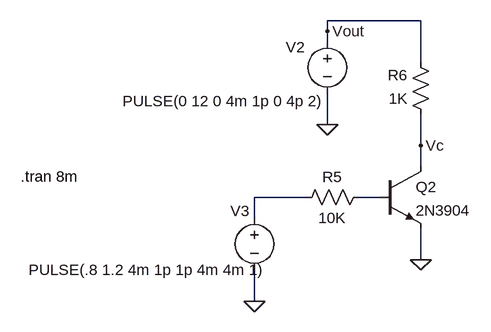
[diagram p0: schematic NPN Basic Configuration.asc]
NPN Basic Configuration.asc, the LTspice schematic file:
Version 4
SHEET 1 1400 680
WIRE 1184 16 1040 16
WIRE 1040 32 1040 16
WIRE 1040 48 1040 32
WIRE 1184 80 1184 16
WIRE 1040 176 1040 128
WIRE 1184 208 1184 160
WIRE 1184 240 1184 208
WIRE 1008 288 928 288
WIRE 1120 288 1088 288
WIRE 928 320 928 288
WIRE 1184 384 1184 336
WIRE 928 448 928 400
FLAG 1040 176 0
FLAG 1184 384 0
FLAG 1040 32 Vout
FLAG 1184 208 Vc
FLAG 928 448 0
SYMBOL voltage 1040 32 R0
WINDOW 123 0 0 Left 2
WINDOW 39 0 0 Left 2
WINDOW 0 -64 25 Left 2
WINDOW 3 -315 108 Left 2
SYMATTR InstName V2
SYMATTR Value PULSE(0 12 0 4m 1p 0 4p 2)
SYMBOL npn 1120 240 R0
SYMATTR InstName Q2
SYMATTR Value 2N3904
SYMBOL res 1200 176 R180
WINDOW 0 36 76 Left 2
WINDOW 3 36 40 Left 2
SYMATTR InstName R6
SYMATTR Value 1K
SYMBOL voltage 928 304 R0
WINDOW 0 -37 5 Left 2
WINDOW 3 -348 96 Left 2
WINDOW 123 0 0 Left 2
WINDOW 39 0 0 Left 2
SYMATTR InstName V3
SYMATTR Value PULSE(.8 1.2 4m 1p 1p 4m 4m 1)
SYMBOL res 1104 272 R90
WINDOW 0 0 56 VBottom 2
WINDOW 3 32 56 VTop 2
SYMATTR InstName R5
SYMATTR Value 10K
TEXT 568 256 Left 2 !.tran 8m

The netlist it stands for:
* NPN Basic Configuration.asc
V2 Vout 0 PULSE(0 12 0 4m 1p 0 4p 2)
Q2 Vc N002 0 0 2N3904
R6 Vc Vout 1K
V3 N001 0 PULSE(.8 1.2 4m 1p 1p 4m 4m 1)
R5 N002 N001 10K
.model NPN NPN
.model PNP PNP
.lib standard.bjt
.tran 8m
.backanno
.end